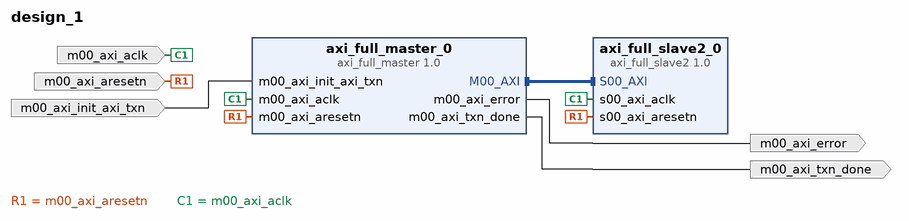
[diagram p0: block diagram of the top level]
# Vivado block design design_1, Vivado 2014.4
create_bd_design design_1

create_bd_port -dir I -type rst m00_axi_aresetn
create_bd_port -dir I -type clk m00_axi_aclk
create_bd_port -dir I m00_axi_init_axi_txn
create_bd_port -dir O m00_axi_txn_done
create_bd_port -dir O m00_axi_error

create_bd_cell -type ip -vlnv xilinx.com:user:axi_full_master:1.0 axi_full_master_0
set_property -dict {CONFIG.C_M00_AXI_BURST_LEN 16} [get_bd_cells axi_full_master_0]
create_bd_cell -type ip -vlnv xilinx.com:user:axi_full_slave2:1.0 axi_full_slave2_0

# ---- connections ----

connect_bd_intf_net [get_bd_intf_pins axi_full_master_0/M00_AXI] [get_bd_intf_pins axi_full_slave2_0/S00_AXI]
connect_bd_net [get_bd_ports m00_axi_aresetn] [get_bd_pins axi_full_master_0/m00_axi_aresetn] [get_bd_pins axi_full_slave2_0/s00_axi_aresetn]
connect_bd_net [get_bd_ports m00_axi_aclk] [get_bd_pins axi_full_master_0/m00_axi_aclk] [get_bd_pins axi_full_slave2_0/s00_axi_aclk]
connect_bd_net [get_bd_ports m00_axi_init_axi_txn] [get_bd_pins axi_full_master_0/m00_axi_init_axi_txn]
connect_bd_net [get_bd_pins axi_full_master_0/m00_axi_txn_done] [get_bd_ports m00_axi_txn_done]
connect_bd_net [get_bd_pins axi_full_master_0/m00_axi_error] [get_bd_ports m00_axi_error]

validate_bd_design
save_bd_design
